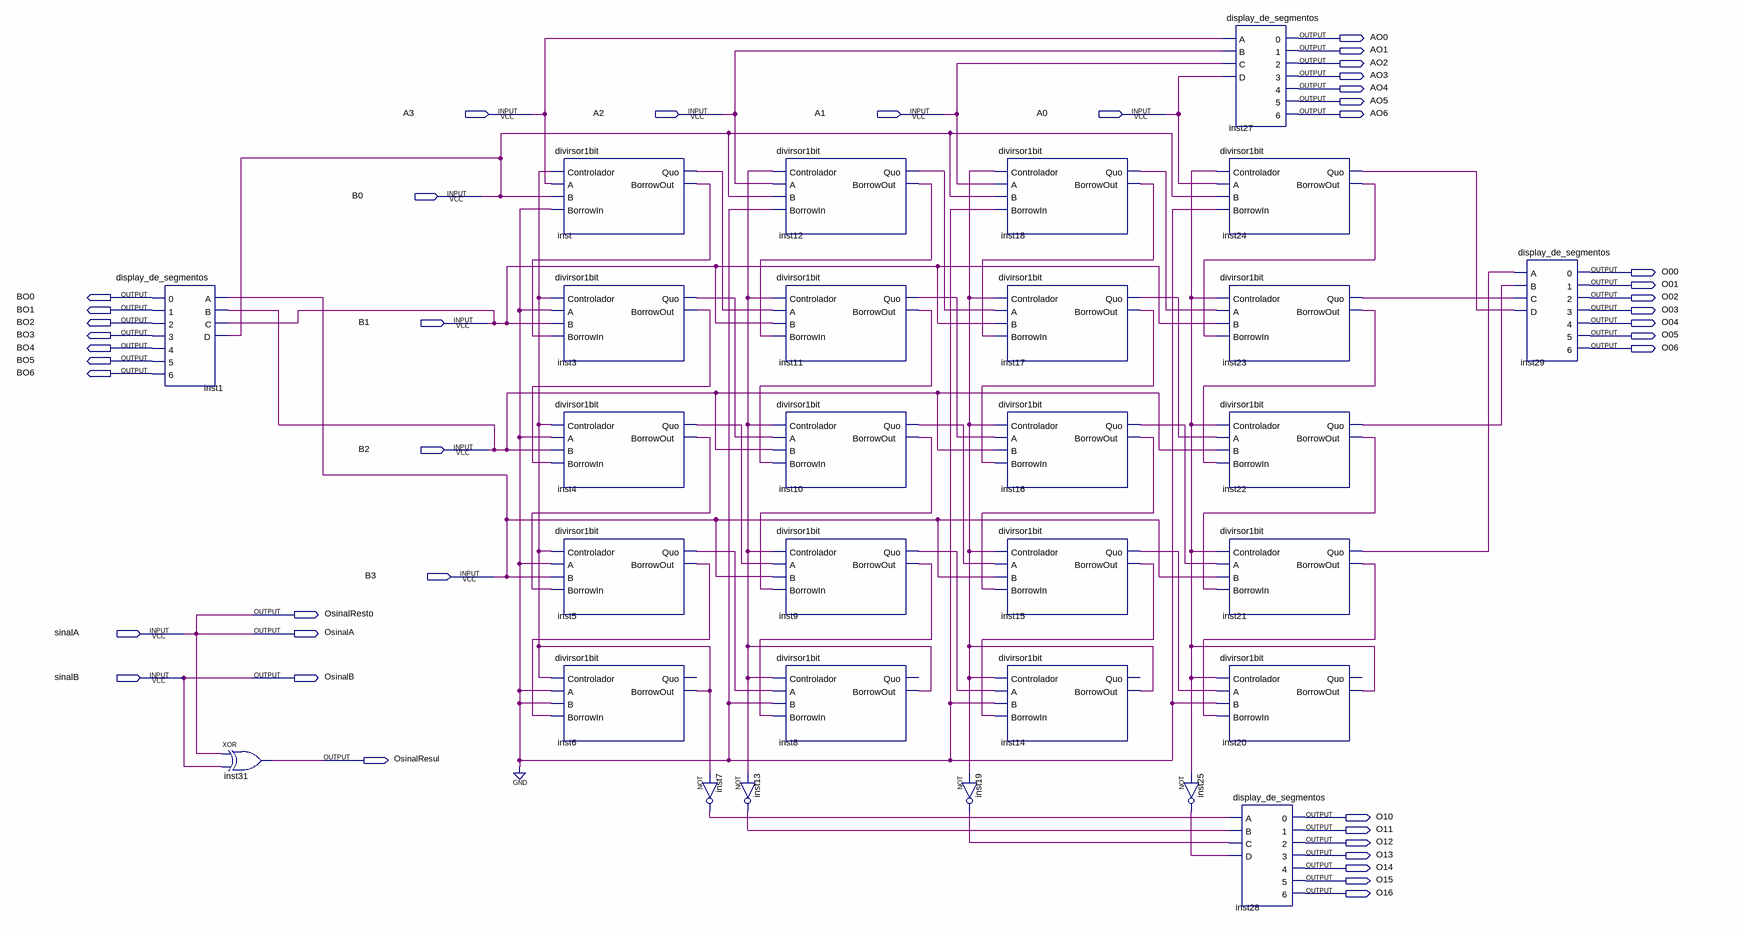
[diagram p0: schematic sheet]
// Quartus schematic divisor4bit.bdf as structural Verilog: 29 symbols, 42 pins
module divisor4bit (
  input  A3,
  input  A2,
  input  A1,
  input  A0,
  input  B0,
  input  B1,
  input  B2,
  input  B3,
  input  sinalA,
  input  sinalB,
  output AO0,
  output AO1,
  output AO2,
  output AO3,
  output AO4,
  output AO5,
  output AO6,
  output O00,
  output O01,
  output BO0,
  output O02,
  output BO1,
  output O03,
  output BO2,
  output O04,
  output BO3,
  output O05,
  output BO4,
  output O06,
  output BO5,
  output BO6,
  output OsinalResto,
  output OsinalA,
  output OsinalB,
  output OsinalResul,
  output O10,
  output O11,
  output O12,
  output O13,
  output O14,
  output O15,
  output O16
);

  wire inst3_borrowout, inst3_quo, inst4_borrowout, inst4_quo, inst5_borrowout, inst5_quo, inst6_borrowout,
       inst7_out, inst8_borrowout, inst9_borrowout, inst9_quo, inst10_borrowout, inst10_quo,
       inst11_borrowout, inst11_quo, inst12_borrowout, inst12_quo, inst13_out, inst14_borrowout,
       inst15_borrowout, inst15_quo, inst16_borrowout, inst16_quo, inst17_borrowout, inst17_quo,
       inst18_borrowout, inst18_quo, inst19_out, inst20_borrowout, inst21_borrowout, inst21_quo,
       inst22_borrowout, inst22_quo, inst23_borrowout, inst23_quo, inst24_borrowout, inst24_quo, inst25_out,
       inst_borrowout, inst_quo;

  display_de_segmentos inst1 (
    .A(B3), .B(B2), .C(B1), .D(B0), .\0 (BO0), .\1 (BO1), .\2 (BO2), .\3 (BO3), .\4 (BO4), .\5 (BO5),
    .\6 (BO6));
  xor inst31 (OsinalResul, sinalA, sinalB);
  divirsor1bit inst (
    .Controlador(inst6_borrowout), .A(A3), .B(B0), .BorrowIn(1'b0), .Quo(inst_quo), .BorrowOut(inst_borrowout));
  divirsor1bit inst3 (
    .Controlador(inst6_borrowout), .A(1'b0), .B(B1), .BorrowIn(inst_borrowout), .Quo(inst3_quo),
    .BorrowOut(inst3_borrowout));
  divirsor1bit inst4 (
    .Controlador(inst6_borrowout), .A(1'b0), .B(B2), .BorrowIn(inst3_borrowout), .Quo(inst4_quo),
    .BorrowOut(inst4_borrowout));
  divirsor1bit inst5 (
    .Controlador(inst6_borrowout), .A(1'b0), .B(B3), .BorrowIn(inst4_borrowout), .Quo(inst5_quo),
    .BorrowOut(inst5_borrowout));
  divirsor1bit inst6 (
    .Controlador(inst6_borrowout), .A(1'b0), .B(1'b0), .BorrowIn(inst5_borrowout), .BorrowOut(inst6_borrowout));  // open: Quo
  not inst7 (inst7_out, inst6_borrowout);
  divirsor1bit inst12 (
    .Controlador(inst8_borrowout), .A(A2), .B(B0), .BorrowIn(1'b0), .Quo(inst12_quo),
    .BorrowOut(inst12_borrowout));
  divirsor1bit inst11 (
    .Controlador(inst8_borrowout), .A(inst_quo), .B(B1), .BorrowIn(inst12_borrowout), .Quo(inst11_quo),
    .BorrowOut(inst11_borrowout));
  divirsor1bit inst10 (
    .Controlador(inst8_borrowout), .A(inst3_quo), .B(B2), .BorrowIn(inst11_borrowout), .Quo(inst10_quo),
    .BorrowOut(inst10_borrowout));
  divirsor1bit inst9 (
    .Controlador(inst8_borrowout), .A(inst4_quo), .B(B3), .BorrowIn(inst10_borrowout), .Quo(inst9_quo),
    .BorrowOut(inst9_borrowout));
  divirsor1bit inst8 (
    .Controlador(inst8_borrowout), .A(inst5_quo), .B(1'b0), .BorrowIn(inst9_borrowout),
    .BorrowOut(inst8_borrowout));  // open: Quo
  not inst13 (inst13_out, inst8_borrowout);
  not inst19 (inst19_out, inst14_borrowout);
  divirsor1bit inst18 (
    .Controlador(inst14_borrowout), .A(A1), .B(B0), .BorrowIn(1'b0), .Quo(inst18_quo),
    .BorrowOut(inst18_borrowout));
  divirsor1bit inst17 (
    .Controlador(inst14_borrowout), .A(inst12_quo), .B(B1), .BorrowIn(inst18_borrowout), .Quo(inst17_quo),
    .BorrowOut(inst17_borrowout));
  divirsor1bit inst16 (
    .Controlador(inst14_borrowout), .A(inst11_quo), .B(B2), .BorrowIn(inst17_borrowout), .Quo(inst16_quo),
    .BorrowOut(inst16_borrowout));
  divirsor1bit inst15 (
    .Controlador(inst14_borrowout), .A(inst10_quo), .B(B3), .BorrowIn(inst16_borrowout), .Quo(inst15_quo),
    .BorrowOut(inst15_borrowout));
  divirsor1bit inst14 (
    .Controlador(inst14_borrowout), .A(inst9_quo), .B(1'b0), .BorrowIn(inst15_borrowout),
    .BorrowOut(inst14_borrowout));  // open: Quo
  not inst25 (inst25_out, inst20_borrowout);
  display_de_segmentos inst27 (
    .A(A3), .B(A2), .C(A1), .D(A0), .\0 (AO0), .\1 (AO1), .\2 (AO2), .\3 (AO3), .\4 (AO4), .\5 (AO5),
    .\6 (AO6));
  divirsor1bit inst24 (
    .Controlador(inst20_borrowout), .A(A0), .B(B0), .BorrowIn(1'b0), .Quo(inst24_quo),
    .BorrowOut(inst24_borrowout));
  divirsor1bit inst23 (
    .Controlador(inst20_borrowout), .A(inst18_quo), .B(B1), .BorrowIn(inst24_borrowout), .Quo(inst23_quo),
    .BorrowOut(inst23_borrowout));
  divirsor1bit inst22 (
    .Controlador(inst20_borrowout), .A(inst17_quo), .B(B2), .BorrowIn(inst23_borrowout), .Quo(inst22_quo),
    .BorrowOut(inst22_borrowout));
  divirsor1bit inst21 (
    .Controlador(inst20_borrowout), .A(inst16_quo), .B(B3), .BorrowIn(inst22_borrowout), .Quo(inst21_quo),
    .BorrowOut(inst21_borrowout));
  divirsor1bit inst20 (
    .Controlador(inst20_borrowout), .A(inst15_quo), .B(1'b0), .BorrowIn(inst21_borrowout),
    .BorrowOut(inst20_borrowout));  // open: Quo
  display_de_segmentos inst28 (
    .A(inst7_out), .B(inst13_out), .C(inst19_out), .D(inst25_out), .\0 (O10), .\1 (O11), .\2 (O12),
    .\3 (O13), .\4 (O14), .\5 (O15), .\6 (O16));
  display_de_segmentos inst29 (
    .A(inst21_quo), .B(inst22_quo), .C(inst23_quo), .D(inst24_quo), .\0 (O00), .\1 (O01), .\2 (O02),
    .\3 (O03), .\4 (O04), .\5 (O05), .\6 (O06));

  assign OsinalA = sinalA;
  assign OsinalB = sinalB;
  assign OsinalResto = sinalA;
endmodule
